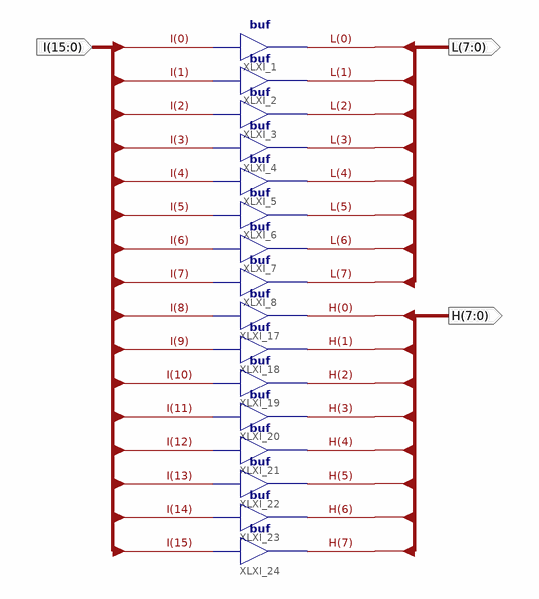
[diagram p0: schematic sheet 1]
// Xilinx ISE schematic split16x8x8.sch (spartan6) as structural Verilog: 16 symbols, 3 ports
module split16x8x8 (
  input  [15:0] I,
  output [7:0] L,
  output [7:0] H
);

  buf XLXI_1 (L[0], I[0]);
  buf XLXI_2 (L[1], I[1]);
  buf XLXI_3 (L[2], I[2]);
  buf XLXI_4 (L[3], I[3]);
  buf XLXI_5 (L[4], I[4]);
  buf XLXI_6 (L[5], I[5]);
  buf XLXI_7 (L[6], I[6]);
  buf XLXI_8 (L[7], I[7]);
  buf XLXI_17 (H[0], I[8]);
  buf XLXI_18 (H[1], I[9]);
  buf XLXI_19 (H[2], I[10]);
  buf XLXI_20 (H[3], I[11]);
  buf XLXI_21 (H[4], I[12]);
  buf XLXI_22 (H[5], I[13]);
  buf XLXI_23 (H[6], I[14]);
  buf XLXI_24 (H[7], I[15]);
endmodule
